# EAGLE board DeMux2 (EAGLE 6.6.0), part 1 of 2
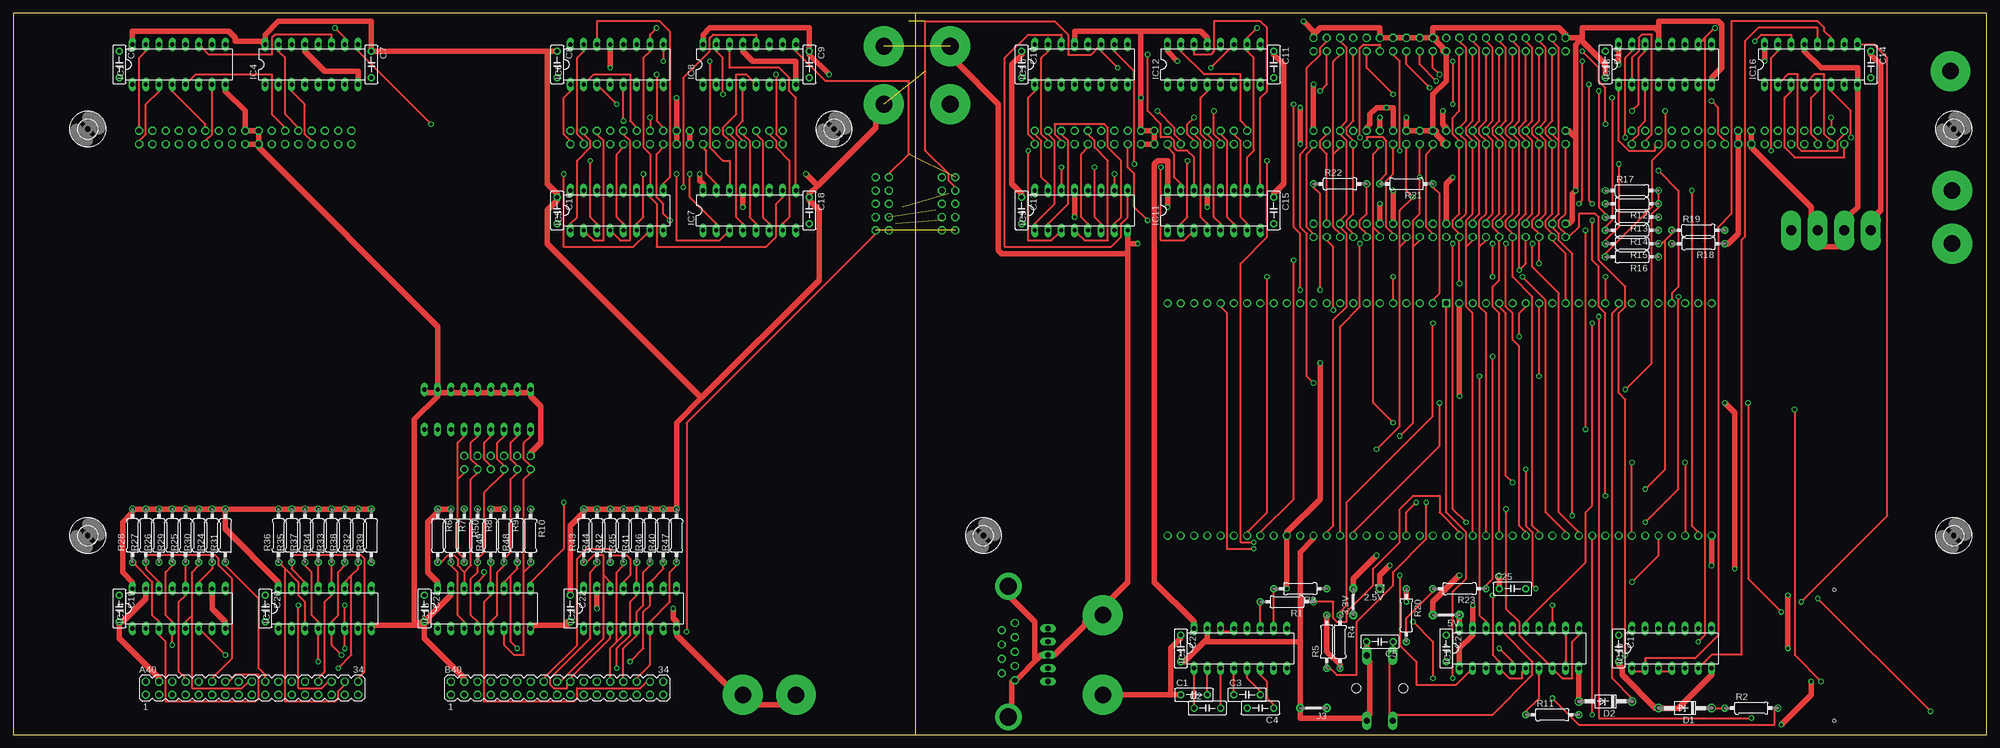
[diagram p3: board, top side]
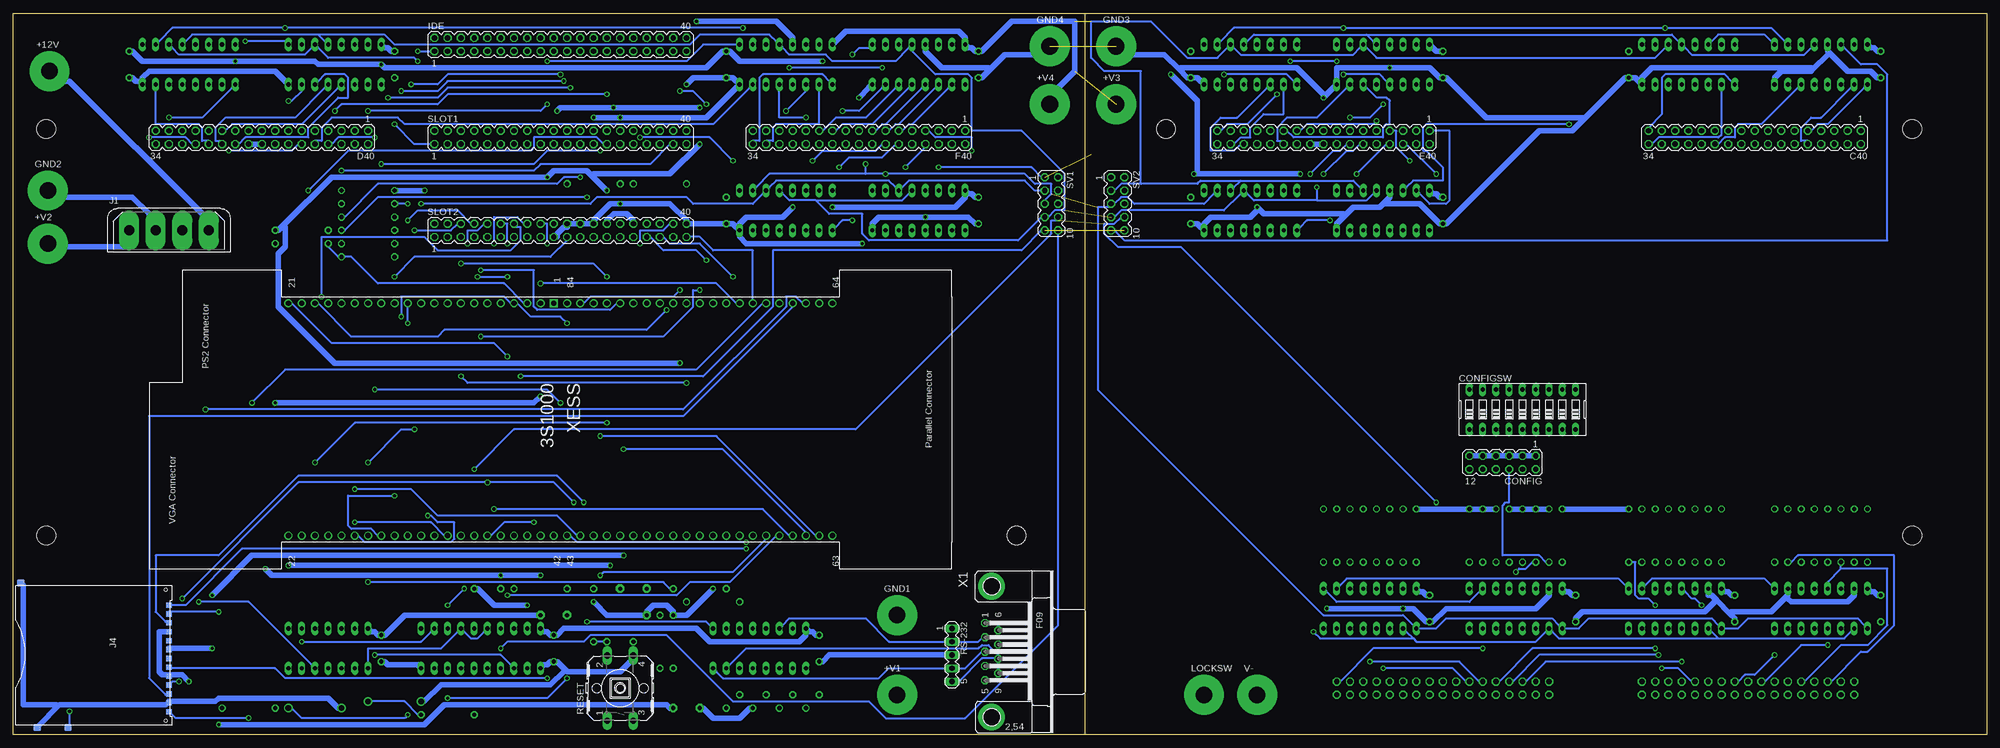
[diagram p4: board, bottom side, seen from below]

Size 377.82 x 138.11 mm. Coordinates in mm from the lower left corner, seen from the top.
Outline: 377.82,138.11 377.82,0 174.62,0 172.72,0
Outline: 377.82,138.11 173.04,138.11
Outline: 173.04,138.11 172.72,138.11
Outline: 172.72,138.11 0,138.11 0,0 172.72,0
Outline: 377.82,138.11 173.04,138.11
Outline: 172.72,138.11 172.72,0
Copper layers (1*16): Top 0.035mm / dielectric 1.5mm / Bottom 0.035mm
Design rules "15mils": minimum track width 15mil, minimum drill 24mil, track to track 15mil, track to pad 10mil, pad to pad 10mil, via to via 10mil, smd to smd 10mil, copper to edge 25mil, drill to drill 10mil, minimum pad ring 10mil, minimum via ring 8mil, stop-mask expansion 0mil, vias tented up to drill 0mil, thermal gap 10mil
Net classes: 1 supply: width 1.016 mm

## Footprints (pad centres in the part's own frame; a part is rotated, then mirrored left to right if it is on the bottom)
1,6/0,8 = drill 0.813 pad 1.6 octagon: 1 0,0
05 = drill 0.813 pad 1.6 octagon: 1 -2.54,0; 2 2.54,0
SPADELUG = drill 3.175 pad 7.62: 1 0,0
MA17-2 = drill 1.016 octagon: 1 -20.32,-1.27; 2 -20.32,1.27; 3 -17.78,-1.27; 4 -17.78,1.27; 5 -15.24,-1.27; 6 -15.24,1.27; 7 -12.7,-1.27; 8 -12.7,1.27; 9 -10.16,-1.27; 10 -10.16,1.27; 11 -7.62,-1.27; 12 -7.62,1.27; 13 -5.08,-1.27; 14 -5.08,1.27; 15 -2.54,-1.27; 16 -2.54,1.27; 17 0,-1.27; 18 0,1.27; 19 2.54,-1.27; 20 2.54,1.27; 21 5.08,-1.27; 22 5.08,1.27; 23 7.62,-1.27; 24 7.62,1.27; 25 10.16,-1.27; 26 10.16,1.27; 27 12.7,-1.27; 28 12.7,1.27; 29 15.24,-1.27; 30 15.24,1.27; 31 17.78,-1.27; 32 17.78,1.27; 33 20.32,-1.27; 34 20.32,1.27
C050-025X075 = drill 0.813 octagon: 1 -2.54,0; 2 2.54,0
MA06-2 = drill 1.016 octagon: 1 -6.35,-1.27; 2 -6.35,1.27; 3 -3.81,-1.27; 4 -3.81,1.27; 5 -1.27,-1.27; 6 -1.27,1.27; 7 1.27,-1.27; 8 1.27,1.27; 9 3.81,-1.27; 10 3.81,1.27; 11 6.35,-1.27; 12 6.35,1.27
EDG-09 = drill 0.813 long: 1 -10.16,-3.81; 2 -7.62,-3.81; 3 -5.08,-3.81; 4 -2.54,-3.81; 5 0,-3.81; 6 2.54,-3.81; 7 5.08,-3.81; 8 7.62,-3.81; 9 10.16,-3.81; 10 10.16,3.81; 11 7.62,3.81; 12 5.08,3.81; 13 2.54,3.81; 14 0,3.81; 15 -2.54,3.81; 16 -5.08,3.81; 17 -7.62,3.81; 18 -10.16,3.81
DO41Z10 = drill 1.118: A 5.08,0; C -5.08,0
DIL16 = drill 0.813 long: 1 -8.89,-3.81; 2 -6.35,-3.81; 3 -3.81,-3.81; 4 -1.27,-3.81; 5 1.27,-3.81; 6 3.81,-3.81; 7 6.35,-3.81; 8 8.89,-3.81; 9 8.89,3.81; 10 6.35,3.81; 11 3.81,3.81; 12 1.27,3.81; 13 -1.27,3.81; 14 -3.81,3.81; 15 -6.35,3.81; 16 -8.89,3.81
DIL20 = drill 0.813 long: 1 -11.43,-3.81; 2 -8.89,-3.81; 3 -6.35,-3.81; 4 -3.81,-3.81; 5 -1.27,-3.81; 6 1.27,-3.81; 7 3.81,-3.81; 8 6.35,-3.81; 9 8.89,-3.81; 10 11.43,-3.81; 11 11.43,3.81; 12 8.89,3.81; 13 6.35,3.81; 14 3.81,3.81; 15 1.27,3.81; 16 -1.27,3.81; 17 -3.81,3.81; 18 -6.35,3.81; 19 -8.89,3.81; 20 -11.43,3.81
DIL14 = drill 0.813 long: 1 -7.62,-3.81; 2 -5.08,-3.81; 3 -2.54,-3.81; 4 0,-3.81; 5 2.54,-3.81; 6 5.08,-3.81; 7 7.62,-3.81; 8 7.62,3.81; 9 5.08,3.81; 10 2.54,3.81; 11 0,3.81; 12 -2.54,3.81; 13 -5.08,3.81; 14 -7.62,3.81
MA20-2 = drill 1.016 octagon: 1 -24.13,-1.27; 2 -24.13,1.27; 3 -21.59,-1.27; 4 -21.59,1.27; 5 -19.05,-1.27; 6 -19.05,1.27; 7 -16.51,-1.27; 8 -16.51,1.27; 9 -13.97,-1.27; 10 -13.97,1.27; 11 -11.43,-1.27; 12 -11.43,1.27; 13 -8.89,-1.27; 14 -8.89,1.27; 15 -6.35,-1.27; 16 -6.35,1.27; 17 -3.81,-1.27; 18 -3.81,1.27; 19 -1.27,-1.27; 20 -1.27,1.27; 21 1.27,-1.27; 22 1.27,1.27; 23 3.81,-1.27; 24 3.81,1.27; 25 6.35,-1.27; 26 6.35,1.27; 27 8.89,-1.27; 28 8.89,1.27; 29 11.43,-1.27; 30 11.43,1.27; 31 13.97,-1.27; 32 13.97,1.27; 33 16.51,-1.27; 34 16.51,1.27; 35 19.05,-1.27; 36 19.05,1.27; 37 21.59,-1.27; 38 21.59,1.27; 39 24.13,-1.27; 40 24.13,1.27
FLOPPY-4 = drill 1.93 pad 3.81 long: 1 7.62,0; 2 2.54,0; 3 -2.54,0; 4 -7.62,0
SCDA5A = smd 1 x 1.3: 1 -7.525,-0.65; 2 -5.825,-0.65; 3 -4.125,-0.65; 3A -2.425,-0.65; 4 -0.725,-0.65; 4A 0.975,-0.65; 5 2.675,-0.65; 6 4.375,-0.65; 7 6.075,-0.65; 8 7.775,-0.65; 9 -9.225,-0.65; 10 11.175,-0.65; 11 9.475,-0.65 | smd 1.4 x 1.4: 12 14.2,-19.955; 13 14.2,-25.875; 14 -13.475,-28.975 | hole 0.61: 12.875,-1.235; -12.125,-1.235
0207/10 = drill 0.813 octagon: 1 -5.08,0; 2 5.08,0
B3F-40XX = drill 1.194 long: 1 -6.248,2.489; 2 6.248,2.489; 3 -6.248,-2.489; 4 6.248,-2.489 | hole 1.803: 0,-4.496; 0,4.496
MA05-1 = drill 1.016 long: 1 -5.08,0; 2 -2.54,0; 3 0,0; 4 2.54,0; 5 5.08,0
MA05-2 = drill 1.016 octagon: 1 -5.08,-1.27; 2 -5.08,1.27; 3 -2.54,-1.27; 4 -2.54,1.27; 5 0,-1.27; 6 0,1.27; 7 2.54,-1.27; 8 2.54,1.27; 9 5.08,-1.27; 10 5.08,1.27
3,6 = hole 3.6: 0,0
F09HP = drill 1.016 octagon: 1 -5.486,-1.27; 2 -2.743,-1.27; 3 0,-1.27; 4 2.743,-1.27; 5 5.486,-1.27; 6 -4.115,1.27; 7 -1.372,1.27; 8 1.372,1.27; 9 4.115,1.27 | drill 3.302 pad 5.08: G1 -12.522,0; G2 12.522,0
3S1000 = drill 1.016 square: 1 0,0 | drill 1.016: 2 0,-2.54; 3 0,-5.08; 4 0,-7.62; 5 0,-10.16; 6 0,-12.7; 7 0,-15.24; 8 0,-17.78; 9 0,-20.32; 10 0,-22.86; 11 0,-25.4; 12 0,-27.94; 13 0,-30.48; 14 0,-33.02; 15 0,-35.56; 16 0,-38.1; 17 0,-40.64; 18 0,-43.18; 19 0,-45.72; 20 0,-48.26; 21 0,-50.8; 22 44.45,-50.8; 23 44.45,-48.26; 24 44.45,-45.72; 25 44.45,-43.18; 26 44.45,-40.64; 27 44.45,-38.1; 28 44.45,-35.56; 29 44.45,-33.02; 30 44.45,-30.48; 31 44.45,-27.94; 32 44.45,-25.4; 33 44.45,-22.86; 34 44.45,-20.32; 35 44.45,-17.78; 36 44.45,-15.24; 37 44.45,-12.7; 38 44.45,-10.16; 39 44.45,-7.62; 40 44.45,-5.08; 41 44.45,-2.54; 42 44.45,0; 43 44.45,2.54; 44 44.45,5.08; 45 44.45,7.62; 46 44.45,10.16; 47 44.45,12.7; 48 44.45,15.24; 49 44.45,17.78; 50 44.45,20.32; 51 44.45,22.86; 52 44.45,25.4; 53 44.45,27.94; 54 44.45,30.48; 55 44.45,33.02; 56 44.45,35.56; 57 44.45,38.1; 58 44.45,40.64; 59 44.45,43.18; 60 44.45,45.72; 61 44.45,48.26; 62 44.45,50.8; 63 44.45,53.34; 64 0,53.34; 65 0,50.8; 66 0,48.26; 67 0,45.72; 68 0,43.18; 69 0,40.64; 70 0,38.1; 71 0,35.56; 72 0,33.02; 73 0,30.48; 74 0,27.94; 75 0,25.4; 76 0,22.86; 77 0,20.32; 78 0,17.78; 79 0,15.24; 80 0,12.7; 81 0,10.16; 82 0,7.62; 83 0,5.08; 84 0,2.54

## Placement (x,y rotation side)
2.5V  [1,6/0,8]  261.62,27.94 180 top
3.3V  J5MM  [05]  256.54,25.4 90 top
5V  J5MM  [05]  274.32,22.86 180 top
+12V  LUG  [SPADELUG]  370.84,127 0 bottom
+V1  LUG  [SPADELUG]  208.6,7.62 0 bottom
+V2  LUG  [SPADELUG]  371.16,93.98 0 bottom
+V3  LUG  [SPADELUG]  166.69,120.65 0 bottom
+V4  LUG  [SPADELUG]  179.39,120.65 0 bottom
A40  [MA17-2]  45.72,8.89 0 top
B40  [MA17-2]  104.14,8.89 0 top
C1  0.1uf  [C050-025X075]  226.06,7.62 0 top
C2  0.1uf  [C050-025X075]  228.6,5.08 0 top
C3  0.1uf  [C050-025X075]  236.22,7.62 0 top
C4  0.1uf  [C050-025X075]  238.76,5.08 180 top
C5  0.1uf  [C050-025X075]  261.62,17.78 180 top
C6  0.1uf  [C050-025X075]  20.32,128.27 270 top
C7  0.1uf  [C050-025X075]  68.58,128.27 270 top
C8  0.1uf  [C050-025X075]  104.14,128.27 270 top
C9  0.1uf  [C050-025X075]  152.4,128.27 270 top
C10  0.1uf  [C050-025X075]  193.04,128.27 270 top
C11  0.1uf  [C050-025X075]  241.3,128.27 270 top
C12  0.1uf  [C050-025X075]  304.8,128.27 270 top
C13  0.1uf  [C050-025X075]  193.04,100.33 270 top
C14  0.1uf  [C050-025X075]  355.6,128.27 270 top
C15  0.1uf  [C050-025X075]  241.3,100.33 270 top
C16  0.1uf  [C050-025X075]  104.14,100.33 270 top
C17  0.1uf  [C050-025X075]  307.34,16.51 270 top
C18  0.1uf  [C050-025X075]  152.4,100.33 270 top
C19  0.1uf  [C050-025X075]  20.32,24.13 270 top
C20  0.1uf  [C050-025X075]  48.26,24.13 270 top
C21  0.1uf  [C050-025X075]  78.74,24.13 270 top
C22  0.1uf  [C050-025X075]  106.68,24.13 270 top
C23  0.1uf  [C050-025X075]  223.52,16.51 270 top
C24  0.1uf  [C050-025X075]  274.32,16.51 270 top
C25  0.1uf  [C050-025X075]  287.02,27.94 0 top
C40  [MA17-2]  44.45,114.3 180 bottom
CONFIG  [MA06-2]  92.71,52.07 180 bottom
CONFIGSW  [EDG-09]  88.9,62.23 0 bottom
D1  1N4728  [DO41Z10]  320.04,5.08 180 top
D2  1N4728  [DO41Z10]  304.8,6.35 180 top
D40  [MA17-2]  330.2,114.3 180 bottom
E40  [MA17-2]  127,114.3 180 bottom
F40  [MA17-2]  215.9,114.3 180 bottom
GND1  LUG  [SPADELUG]  208.6,22.86 0 bottom
GND2  LUG  [SPADELUG]  371.16,104.14 0 bottom
GND3  LUG  [SPADELUG]  166.69,131.76 0 bottom
GND4  LUG  [SPADELUG]  179.39,131.76 0 bottom
IC1  74HC595N  [DIL16]  31.75,128.27 0 top
IC2  74HC165N  [DIL16]  118.11,24.13 0 top
IC3  MAX232A  [DIL16]  234.95,16.51 0 top
IC4  74HC595N  [DIL16]  57.15,128.27 0 top
IC5  74HC595N  [DIL16]  115.57,100.33 0 top
IC6  74HC595N  [DIL16]  115.57,128.27 0 top
IC7  74HC595N  [DIL16]  140.97,100.33 0 top
IC8  74HC595N  [DIL16]  140.97,128.27 0 top
IC9  74HC595N  [DIL16]  204.47,100.33 0 top
IC10  74HC595N  [DIL16]  204.47,128.27 0 top
IC11  74HC595N  [DIL16]  229.87,100.33 0 top
IC12  74HC595N  [DIL16]  229.87,128.27 0 top
IC13  74HC595N  [DIL16]  316.23,128.27 0 top
IC14  74HC165N  [DIL16]  31.75,24.13 0 top
IC15  74HC165N  [DIL16]  59.69,24.13 0 top
IC16  74HC595N  [DIL16]  344.17,128.27 0 top
IC17  74LS244N  [DIL20]  288.29,16.51 0 top
IC18  74HC165N  [DIL16]  90.17,24.13 0 top
IC19  74ALS00N  [DIL14]  317.5,16.51 0 top
IDE  [MA20-2]  273.05,132.08 0 bottom
J1  [FLOPPY-4]  347.98,96.52 0 bottom
J3  J5MM  [05]  248.92,5.08 180 top
J4  SDCARD  [SCDA5A]  347.35,15.56 270 bottom
LOCKSW  LUG  [SPADELUG]  149.86,7.62 0 bottom
R1  330  [0207/10]  243.84,25.4 180 top
R2  330  [0207/10]  332.74,5.08 0 top
R3  330  [0207/10]  246.38,27.94 180 top
R4  330  [0207/10]  254,17.78 270 top
R5  330  [0207/10]  251.46,17.78 90 top
R6  3K  [0207/10]  81.28,38.1 270 top
R7  3K  [0207/10]  83.82,38.1 270 top
R8  3K  [0207/10]  88.9,38.1 270 top
R9  3K  [0207/10]  93.98,38.1 270 top
R10  3K  [0207/10]  99.06,38.1 270 top
R11  330  [0207/10]  294.64,3.81 0 top
R12  330  [0207/10]  309.88,101.6 180 top
R13  47  [0207/10]  309.88,99.06 180 top
R14  47  [0207/10]  309.88,96.52 180 top
R15  330  [0207/10]  309.88,93.98 180 top
R16  330  [0207/10]  309.88,91.44 180 top
R17  10K  [0207/10]  309.88,104.14 0 top
R18  10K  [0207/10]  322.58,93.98 180 top
R19  10K  [0207/10]  322.58,96.52 0 top
R20  4.7K  [0207/10]  266.7,22.86 270 top
R21  330  [0207/10]  266.7,105.41 180 top
R22  330  [0207/10]  254,105.41 0 top
R23  330  [0207/10]  276.86,27.94 180 top
R24  3K  [0207/10]  38.1,38.1 90 top
R25  3K  [0207/10]  33.02,38.1 90 top
R26  3K  [0207/10]  27.94,38.1 90 top
R27  3K  [0207/10]  25.4,38.1 90 top
R28  3K  [0207/10]  22.86,38.1 90 top
R29  3K  [0207/10]  30.48,38.1 90 top
R30  3K  [0207/10]  35.56,38.1 90 top
R31  3K  [0207/10]  40.64,38.1 90 top
R32  3K  [0207/10]  66.04,38.1 90 top
R33  3K  [0207/10]  60.96,38.1 90 top
R34  3K  [0207/10]  58.42,38.1 90 top
R35  3K  [0207/10]  53.34,38.1 90 top
R36  3K  [0207/10]  50.8,38.1 90 top
R37  3K  [0207/10]  55.88,38.1 90 top
R38  3K  [0207/10]  63.5,38.1 90 top
R39  3K  [0207/10]  68.58,38.1 90 top
R40  3K  [0207/10]  124.46,38.1 90 top
R41  3K  [0207/10]  119.38,38.1 90 top
R42  3K  [0207/10]  114.3,38.1 90 top
R43  3K  [0207/10]  109.22,38.1 90 top
R44  3K  [0207/10]  111.76,38.1 90 top
R45  3K  [0207/10]  116.84,38.1 90 top
R46  3K  [0207/10]  121.92,38.1 90 top
R47  3K  [0207/10]  127,38.1 90 top
R48  3K  [0207/10]  96.52,38.1 90 top
R49  3K  [0207/10]  91.44,38.1 90 top
R50  3K  [0207/10]  86.36,38.1 270 top
RESET  [B3F-40XX]  261.62,8.89 90 bottom
RS-232  [MA05-1]  198.12,15.24 270 bottom
SLOT1  [MA20-2]  273.05,114.3 0 bottom
SLOT2  [MA20-2]  273.05,96.52 0 bottom
SV1  [MA05-2]  179.07,101.6 270 bottom
SV2  [MA05-2]  166.37,101.6 270 bottom
U$5  [3,6]  371.48,115.89 0 top
U$6  [3,6]  371.48,38.1 0 top
U$7  [3,6]  185.74,38.1 0 top
U$8  [3,6]  14.29,38.1 0 top
U$9  [3,6]  14.29,115.89 0 top
U$11  [3,6]  157.16,115.89 0 top
V-  LUG  [SPADELUG]  139.7,7.62 0 bottom
X1  [F09HP]  190.5,15.88 270 bottom
XESS  3S1000  [3S1000]  274.32,82.55 270 bottom

## Tracks (layer width: path | path; a pad name or v marks a point on that pad's centre or on a via)
3S-LSCK  (via drill 0.61)
  Top 0.381: IC17.6 288.93,12.06 288.93,10.79 286.38,10.79 285.12,12.06 IC17.4 284.48,13.97 283.21,15.24 v283.21,26.67
  Bottom 0.381: v283.21,26.67 250.82,26.67 248.28,29.21 240.66,29.21 231.78,38.1 XESS.59
3S-LSER  (via drill 0.61)
  Top 0.381: v265.43,30.48 265.43,17.14 268.61,13.97 268.61,9.53 276.23,9.53 278.76,12.06 IC17.2
  Bottom 0.381: v265.43,30.48 264.8,31.11 240.03,31.11 233.68,37.47 XESS.58
3S-SCLK  (via drill 0.61)
  Top 0.381: v302.26,78.74 302.26,43.81 300.99,42.55 300.99,33.02 289.56,21.59 IC17.15
  Bottom 0.381: v302.26,78.74 302.26,81.92 XESS.12
3S-SSER
  Top 0.381: XESS.14 307.34,81.92 306.07,80.64 306.07,10.79 309.88,6.99 D2.C
  Bottom 0.381: R11.2 300.36,3.81 302.89,6.35 309.25,6.35 D2.C
!3S-SCL  (via drill 0.61)
  Top 0.381: IC17.11 299.72,19.05 298.45,17.78 298.45,10.79 296.55,10.79 295.27,12.06 IC17.8 294,13.34 288.29,19.05 288.29,21.59 285.75,24.13 v285.75,43.18
  Bottom 0.381: v285.75,43.18 234.31,43.18 229.24,38.1 XESS.60
!SCL  (via drill 0.61)  (1 unrouted)
  Top 0.381: v210.82,107.31 210.82,105.41 IC9.10 | v214.63,109.22 214.63,127 210.82,130.81 IC10.10 | IC11.10 236.22,105.41 236.22,110.49 237.49,111.76 237.49,129.54 236.22,130.81 IC12.10 236.22,133.35 v238.12,135.25 | IC17.9 297.18,13.97 297.18,19.05 IC17.12 | v325.75,135.25 323.85,133.35 | 323.85,133.35 323.21,132.72 IC13.10 | v322.58,17.78 323.85,19.05 323.85,133.35 | v61.59,135.25 63.5,133.35 IC4.10 | v123.19,135.25 121.92,133.99 121.92,133.35 IC6.10 121.92,130.81 120.65,129.54 120.65,112.39 121.92,111.12 121.92,105.41 IC5.10 121.92,102.87 123.19,101.6 123.19,93.34 144.15,93.34 146.05,95.25 146.05,101.6 147.32,102.87 IC7.10
  Bottom 0.381: 214.63,107.31 233.04,107.31 235.59,104.78 IC11.10 | 214.63,107.31 v210.82,107.31 184.15,107.31 182.25,105.41 179.07,105.41 179.07,103.5 180.34,102.23 SV1.5 | 214.63,107.31 v214.63,109.22 | IC16.10 349.88,132.72 347.35,135.25 v325.75,135.25 v238.12,135.25 | v322.58,17.78 299.72,17.78 297.81,19.68 IC17.12 | IC14.1 23.5,20.95 24.77,22.23 45.72,22.23 47.62,20.32 50.16,20.32 IC15.1 51.44,20.95 52.7,22.23 76.2,22.23 78.11,20.32 80.64,20.32 IC18.1 81.92,20.95 83.19,22.23 103.5,22.23 105.41,20.32 108.58,20.32 IC2.1 109.86,20.95 111.76,22.86 127,22.86 170.18,66.04 170.18,100.97 167.64,100.97 SV2.5 167,101.6 165.74,102.87 164.47,102.87 163.19,101.6 149.86,101.6 147.96,103.5 IC7.10 | IC1.10 38.73,132.72 41.27,135.25 v61.59,135.25 v123.19,135.25 144.15,135.25 146.69,132.72 IC8.10
+2V5  (via drill 0.61)
  Top 1.016: v325.12,32.38 325.12,37.47 XESS.22 | v263.52,32.38 261.62,30.48 261.62,28.57 2.5V.1
  Bottom 1.016: v263.52,32.38 v325.12,32.38
+3V3  (via drill 0.61)
  Top 1.016: R4.2 254,13.34 251.46,15.88 251.46,22.23 R5.2 | v266.7,25.4 266.7,27.3 R20.1 | v243.84,27.94 243.84,37.47 XESS.54 243.84,38.73 250.19,45.09 v250.19,71.12 | SLOT1.32 259.08,116.2 259.71,116.84 259.71,118.75 260.99,120.02 v262.89,120.02 264.16,120.02 264.16,116.2 SLOT1.28 | v273.69,119.38 273.69,116.84 274.32,116.2 SLOT1.20 | v275.59,106.68 274.32,105.41 274.32,98.42 SLOT2.20 | v264.16,104.14 264.16,98.42 SLOT2.28 | v246.38,113.03 v246.38,120.02
  Bottom 1.016: v266.7,25.4 264.16,22.86 257.18,22.86 3.3V.1 256.54,23.5 255.27,24.77 252.73,24.77 251.46,23.5 R5.2 250.82,22.86 248.92,22.86 v243.84,27.94 | v273.69,119.38 273.05,120.02 v262.89,120.02 v246.38,120.02 | SLOT2.32 259.08,98.42 260.35,99.69 262.89,99.69 264.16,98.42 SLOT2.28 | 326.07,97.47 316.87,106.68 v275.59,106.68 274.32,107.95 267.97,107.95 267.02,107 | 326.07,97.47 327.02,96.52 R19.2 | 267.02,107 v264.16,104.14 | v246.38,113.03 252.09,107.31 266.7,107.31 267.02,107 | v250.19,71.12 316.23,71.12 327.02,81.92 327.02,92.08 325.75,93.34 325.75,97.16 326.07,97.47
+5V  (via drill 0.61)
  Top 1.016: v284.48,30.48 284.48,28.57 C25.1 | v276.86,30.48 271.78,25.4 271.78,23.5 5V.2 | v276.86,64.77 276.86,81.92 XESS.2 | v327.66,63.5 329.56,61.59 v329.56,31.75
  Bottom 1.016: v276.86,30.48 v284.48,30.48 328.3,30.48 v329.56,31.75 | v276.86,64.77 278.13,63.5 v327.66,63.5
+12V
  Bottom 1.016: J1.1 341.63,99.69 367.03,125.09 367.67,125.09 +12V.1
AC0  (via drill 0.61)
  Top 0.381: v110.49,109.86 110.49,99.06 111.76,97.79 IC5.3
  Bottom 0.381: v110.49,109.86 113.03,112.39 113.03,115.57 113.67,115.57 E40.7
AC1
  Top 0.381: IC6.15 109.22,130.81 107.95,129.54 107.95,114.94 109.22,113.67 E40.4
AC2  (via drill 0.61)
  Top 0.381: v116.84,117.47 116.84,123.19 IC6.5
  Bottom 0.381: v116.84,117.47 117.47,116.84 130.18,116.84 131.44,115.57 E40.21
AC3  (via drill 0.61)
  Top 0.381: v129.54,107.31 129.54,102.87 134.62,97.79 IC7.2
  Bottom 0.381: v129.54,107.31 125.09,111.76 123.83,111.76 122.56,113.03 E40.14
AC4
  Top 0.381: IC7.7 147.32,97.79 148.59,99.06 148.59,109.86 146.05,112.39 146.05,113.67 144.78,114.94 E40.31
AC5
  Top 0.381: IC8.4 139.7,123.19 139.7,117.47 138.43,116.2 138.43,114.94 139.7,113.67 E40.28
AC6  (via drill 0.61)
  Top 0.381: v194.31,111.76 194.31,94.61 198.75,94.61 200.03,95.89 IC9.3
  Bottom 0.381: v194.31,111.76 194.31,114.3 201.29,114.3 202.56,115.57 F40.7
AC7
  Top 0.381: IC10.15 198.12,130.81 196.85,129.54 196.85,114.94 198.12,113.67 F40.4
AC8
  Bottom 0.381: IC10.5 206.38,123.83 213.36,116.84 219.07,116.84 220.34,115.57 F40.21
AC9  (via drill 0.61)
  Top 0.381: v224.79,109.86 224.79,99.06 223.52,97.79 IC11.2
  Bottom 0.381: v224.79,109.86 222.88,111.76 212.72,111.76 211.46,113.03 F40.14
AC10
  Top 0.381: IC11.7 236.22,97.79 234.95,99.06 234.95,113.67 233.68,114.94 F40.31
AC11
  Top 0.381: IC12.4 228.6,123.19 227.33,121.92 227.33,114.94 228.6,113.67 F40.28
AND
  Top 0.381: IC13.3 312.42,123.19 312.42,117.47 311.15,116.2 311.15,114.94 309.88,113.67 D40.2
BREAK
  Bottom 0.381: IC13.6 319.4,125.09 318.13,126.36 314.32,126.36 313.69,125.73 313.69,121.92 315.6,121.92 321.31,116.2 321.31,114.3 333.38,114.3 334.64,113.03 D40.22
CA
  Top 0.381: IC16.4 343.54,125.09 344.81,126.36 346.71,126.36 346.71,114.94 347.98,113.67 D40.32
CF1  (via drill 0.61)
  Top 0.381: 85.09,48.9 85.09,34.92 86.36,33.66 R50.2 | 85.09,48.9 86.36,50.16 CONFIG.2 | 85.09,48.9 85.09,55.88 86.36,57.15 CONFIGSW.6 | v90.17,31.11 90.17,30.48 88.9,29.21 IC18.13
  Bottom 0.381: v90.17,31.11 89.53,31.75 88.27,31.75 87,33.02 R50.2
CF2
  Top 0.381: CONFIGSW.5 88.9,57.15 87.63,55.88 87.63,52.7 88.9,51.44 CONFIG.4 88.9,50.16 87.63,48.9 87.63,32.38 86.36,31.11 | 86.36,31.11 85.09,32.38 85.09,33.66 84.45,34.29 83.19,34.29 81.92,33.02 R6.2 | 86.36,31.11 86.36,29.21 IC18.14
CF3
  Top 0.381: CONFIGSW.4 91.44,57.15 90.17,55.88 90.17,52.7 91.44,51.44 CONFIG.6 | IC18.3 86.36,21.59 85.09,22.86 85.09,31.11 83.82,32.38 R7.2
  Bottom 0.381: CONFIG.6 91.44,50.16 91.44,44.45 92.08,44.45 92.71,43.81 92.71,34.29 85.72,34.29 84.45,33.02 R7.2
CF4
  Top 0.381: CONFIGSW.3 93.98,57.15 92.71,55.88 92.71,52.7 93.98,51.44 CONFIG.8 93.98,50.16 90.17,46.35 90.17,34.92 88.9,33.66 R8.2 88.9,32.38 88.9,31.11 87.63,29.84 87.63,22.86 88.9,21.59 IC18.4
CF5
  Top 0.381: CONFIGSW.2 96.52,57.15 95.25,55.88 95.25,52.7 96.52,51.44 CONFIG.10 96.52,50.16 95.25,48.9 95.25,34.92 93.98,33.66 R9.2 93.98,32.38 92.71,31.11 92.71,22.86 91.44,21.59 IC18.5
CF6
  Top 0.381: CONFIGSW.1 99.06,57.15 97.79,55.88 97.79,52.7 99.06,51.44 CONFIG.12 99.06,50.16 97.79,48.9 97.79,31.11 | 97.79,31.11 97.79,15.24 95.89,15.24 93.98,17.14 93.98,19.05 IC18.6 | 97.79,31.11 99.06,32.38 R10.2
CLK  (via drill 0.61)
  Top 0.381: SLOT2.21 271.78,95.89 270.51,97.16 270.51,111.12 271.78,112.39 SLOT1.21 | v304.8,87.63 304.8,83.19 XESS.13
  Bottom 0.381: v304.8,87.63 300.99,91.44 274.95,91.44 271.78,94.61 SLOT2.21
CONT
  Top 0.381: B40.28 116.84,10.79 116.84,16.51 119.38,19.05 IC2.5 119.38,21.59 119.38,23.5 120.65,24.77 120.65,31.11 121.92,32.38 R46.1
DCA  (via drill 0.61)
  Top 0.381: v308.61,114.3 308.61,129.54 309.88,130.81 IC13.15
  Bottom 0.381: v308.61,114.3 315.6,114.3 316.87,113.03 D40.8
DEFER
  Bottom 0.381: IC16.7 350.52,123.19 350.52,116.84 342.26,116.84 341.63,116.2 341.63,113.67 340.36,113.67 D40.26
DEP
  Top 0.381: IC2.3 114.3,19.05 114.3,18.41 106.68,10.79 B40.20 106.05,10.16 106.05,8.89 103.5,8.89 102.87,9.53 102.87,10.79 110.49,18.41 110.49,31.11 111.76,32.38 R44.1
DF0
  Top 0.381: IC1.15 25.4,130.81 24.13,129.54 24.13,116.2 C40.1
DF1
  Bottom 0.381: IC1.2 26.04,123.83 31.75,118.11 33.66,118.11 35.56,116.2 35.56,113.67 34.29,113.67 C40.10
DF2
  Top 0.381: IC1.4 30.48,123.19 36.83,116.84 36.83,116.2 C40.11
EXAM
  Top 0.381: 115.57,17.78 114.3,16.51 114.3,10.79 B40.26 | 115.57,17.78 116.84,19.05 IC2.4 | 115.57,17.78 115.57,31.11 116.84,32.38 R45.1
EXECUTE  (via drill 0.61)
  Top 0.381: v351.79,114.3 351.79,119.38 347.98,123.19 IC16.6
  Bottom 0.381: v351.79,114.3 344.81,114.3 343.54,113.03 D40.28
FETCH
  Bottom 0.381: IC13.5 318.13,123.83 323.85,118.11 337.19,118.11 339.09,116.2 339.09,113.67 337.82,113.67 D40.24
GND  (via drill 0.61)  (1 unrouted)
  Top 1.016: IC16.13 342.9,130.81 346.07,127.64 353.06,127.64 353.06,125.73 IC16.8 353.06,123.19 353.06,100.97 351.79,99.69 J1.3 349.25,93.34 346.71,93.34 J1.2 344.17,99.69 344.17,100.97 332.74,112.39 D40.20 332.74,113.67 332.74,114.94 D40.19 | R18.1 328.3,93.98 330.2,95.89 330.2,112.39 D40.18 330.2,113.67 330.2,114.94 D40.17 | F40.18 216.53,113.03 217.81,113.03 F40.20 218.44,113.67 218.44,114.94 F40.19 217.81,115.57 216.53,115.57 F40.17 215.9,116.2 v215.9,121.92 215.9,134.62 | 215.9,134.62 227.33,134.62 228.6,133.35 IC12.13 | 215.9,134.62 203.2,134.62 203.2,133.35 IC10.13 | 300.04,133.03 299.72,133.35 297.81,133.35 IDE.2 297.18,133.99 295.91,135.25 271.78,135.25 271.78,133.99 IDE.22 | 300.04,133.03 304.8,128.27 304.8,126.36 C12.2 | 314.64,134.94 314.32,135.25 300.36,135.25 300.36,133.35 300.04,133.03 | 314.64,134.94 314.96,134.62 314.96,133.35 IC13.13 | SLOT2.2 297.81,97.79 298.45,98.42 298.45,103.5 v299.08,104.14 299.08,114.3 298.77,114.62 | 298.77,114.62 297.81,115.57 SLOT1.2 | 300.04,133.03 299.72,132.72 299.08,132.08 299.08,114.94 298.77,114.62 | v248.92,124.46 248.92,116.2 SLOT1.40 | v261.62,118.11 261.62,116.2 SLOT1.30 | SLOT1.22 271.14,115.57 269.88,115.57 SLOT1.24 268.61,115.57 267.33,115.57 SLOT1.26 266.7,116.2 v266.7,118.11 | SLOT1.19 273.69,113.03 273.69,113.67 272.42,114.94 272.42,115.57 SLOT1.22 | 249.24,134.3 250.19,135.25 261.62,135.25 261.62,133.99 IDE.30 262.25,133.35 263.52,133.35 IDE.28 264.8,133.35 266.06,133.35 IDE.26 267.33,133.35 268.61,133.35 IDE.24 269.88,133.35 271.14,133.35 IDE.22 | 249.24,134.3 248.92,133.99 IDE.40
  Top 1.016: IDE.22 272.42,133.35 272.42,132.72 273.69,131.44 273.69,130.81 IDE.19 274.32,130.18 274.32,125.09 271.78,122.56 271.78,116.2 SLOT1.22 | v247.01,136.53 248.92,134.62 249.24,134.3 | IC13.8 325.12,125.73 327.02,127.64 327.02,135.89 326.39,136.53 314.96,136.53 314.96,135.25 314.64,134.94 | IC17.10 299.72,11.43 299.72,6.99 D2.A | IC19.7 325.12,11.43 318.77,5.08 315.6,5.08 D1.A 314.32,5.08 307.98,11.43 307.98,12.7 307.34,13.34 C17.2 | IC17.1 276.86,13.97 276.86,16.51 279.4,19.05 IC17.19 279.4,21.59 v279.4,24.77 | C5.2 259.08,17.14 259.08,16.51 RESET.4 259.71,13.97 259.71,3.81 RESET.3 258.44,3.17 246.38,3.17 246.38,4.45 J3.2 246.38,5.71 246.38,17.78 | 228.28,18.1 228.6,18.41 228.6,19.05 IC3.15 | 228.28,18.1 224.16,13.97 C23.2 | 246.38,17.78 246.38,34.92 248.92,37.47 XESS.52 | 246.38,17.78 228.6,17.78 228.28,18.1 | v261.62,101.6 261.62,98.42 SLOT2.30 | v228.6,100.97 228.6,102.87 IC11.13 | X1.G2 191.13,5.71 191.13,10.16 X1.5 192.41,10.79 195.9,14.29 | 195.9,14.29 196.85,15.24 RS-232.3 199.39,15.24 205.1,20.95 205.1,21.59 GND1.1 210.19,26.04 213.36,29.21 213.36,92.08 | X1.G1 191.13,26.04 195.58,21.59 195.58,14.61 195.9,14.29 | v203.2,99.06 203.2,102.87 IC9.13 | 213.36,92.08 213.36,93.98 | 213.36,93.98 213.36,95.25 IC9.8 | 213.36,93.98 v215.26,93.98 | 213.36,92.08 189.23,92.08 188.59,92.71 188.59,120.65 180.97,128.27 GND4.1 | E40.18 127,113.67 127,114.94 E40.17 127,116.2 v127,121.92 | E40.19 129.54,114.94 129.54,113.67 E40.20 | v114.3,127.64 114.3,130.81 IC6.13 | IC8.13 139.7,130.81 141.6,128.91 149.86,128.91 149.86,125.73 IC8.8 | v139.7,100.97 139.7,102.87 IC7.13
  Top 1.016: IC4.13 55.88,130.81 59.69,127 66.04,127 66.04,125.73 IC4.8 | C40.18 45.09,113.03 46.35,113.03 C40.20 | C40.20 46.99,113.67 46.99,114.94 C40.19 46.35,115.57 45.09,115.57 C40.17 44.45,116.2 44.45,119.38 40.64,123.19 IC1.8 | LOCKSW.1 146.69,5.71 142.88,5.71 V-.1 136.53,9.53 127,19.05 IC2.8 127,21.59 126.36,22.23 v126.36,24.13 | IC14.8 40.64,21.59 38.1,24.13 38.1,26.67 IC14.10 | IC14.15 25.4,26.67 25.4,26.04 20.95,21.59 C19.2 20.32,20.95 20.32,18.41 27.94,10.79 A40.4 | CONFIGSW.11 81.92,65.41 83.19,65.41 CONFIGSW.12 84.45,65.41 85.72,65.41 CONFIGSW.13 87,65.41 88.27,65.41 CONFIGSW.14 89.53,65.41 90.81,65.41 CONFIGSW.15 92.08,65.41 93.34,65.41 CONFIGSW.16 94.61,65.41 95.89,65.41 CONFIGSW.17 97.16,65.41 98.42,65.41 CONFIGSW.18 99.06,64.77 100.97,62.87 100.97,55.88 99.06,53.98 CONFIG.11 | IC18.8 99.69,20.95 106.05,20.95 106.05,21.59 C22.2 | v111.76,24.13 111.76,26.67 IC2.15 | 76.83,20.95 78.11,20.95 78.11,21.59 C21.2 | 76.83,20.95 69.22,20.95 IC15.8 | IC18.15 83.82,26.67 79.38,22.23 79.38,21.59 C21.2 | B40.4 86.36,10.79 78.74,18.41 78.74,20.95 C21.2 | 76.83,20.95 76.83,60.33 81.28,64.77 CONFIGSW.11 | C40.20 46.99,112.39 81.28,78.11 81.28,67.31 CONFIGSW.11 | CONFIGSW.10 79.38,65.41 80.64,65.41 CONFIGSW.11
  Bottom 1.016: IC13.8 325.75,125.09 327.66,127 351.79,127 353.06,125.73 IC16.8 353.69,125.09 354.33,125.09 354.96,125.73 C14.2 | D40.20 332.11,113.03 330.83,113.03 D40.18 | J1.3 351.79,99.69 354.96,102.87 367.67,102.87 GND2.1 | v215.9,121.92 214,123.83 IC10.8 | 190.82,127.32 187.96,130.18 182.88,130.18 GND4.1 | 190.82,127.32 192.41,125.73 C10.2 | IC10.13 203.2,130.81 200.03,127.64 191.13,127.64 190.82,127.32 | v299.08,104.14 304.17,104.14 R17.1 | v248.92,124.46 247.65,125.73 241.94,125.73 C11.2 240.66,125.73 240.03,125.73 239.4,125.09 IC12.8 239.4,123.83 245.11,118.11 v261.62,118.11 v266.7,118.11 | v247.01,136.53 231.78,136.53 228.6,133.35 IC12.13 | 369.25,5.4 372.75,1.91 J4.13 | 369.25,5.4 368.94,5.71 348.62,5.71 J4.11 347.98,6.35 339.09,6.35 338.45,6.99 317.5,6.99 315.6,5.08 D1.A | J4.14 375.92,28.57 375.92,5.71 369.57,5.71 369.25,5.4 | C17.2 306.7,13.97 306.07,13.34 300.36,13.34 IC17.10 | IC17.1 276.23,13.34 275.59,13.34 274.95,13.97 C24.2 273.69,13.97 272.1,12.38 | v279.4,24.77 285.75,24.77 288.93,27.94 C25.2 | C4.2 236.85,5.08 238.76,3.17 243.84,3.17 245.75,5.08 J3.2 | 272.1,12.38 271.78,12.06 261.62,12.06 259.71,13.97 RESET.4 | D2.A 299.08,6.35 295.91,9.53 274.95,9.53 272.42,12.06 272.1,12.38 | SLOT2.19 273.69,95.25 273.69,95.89 272.42,97.16 271.78,97.16 SLOT2.22 271.14,97.79 269.88,97.79 SLOT2.24 268.61,97.79 267.33,97.79 SLOT2.26 266.7,98.42 263.52,101.6 v261.62,101.6 252.09,101.6 248.92,98.42 SLOT2.40 248.28,97.79 241.94,97.79 C15.2 240.66,97.79 240.03,97.79 239.4,97.16 IC11.8 | v228.6,100.97 230.5,99.06 237.49,99.06 238.76,97.79 IC11.8 | IC9.8 213.36,97.79 212.09,99.06 v203.2,99.06 194.94,99.06 193.68,97.79 C13.2
  Bottom 1.016: v215.26,93.98 237.49,93.98 238.76,95.25 IC11.8 | C23.2 222.88,13.97 221.62,15.24 199.39,15.24 RS-232.3 | E40.18 127.64,113.03 128.91,113.03 E40.20 | 126.68,122.24 125.09,123.83 IC6.8 124.46,125.73 124.46,127.64 v114.3,127.64 106.68,127.64 104.78,125.73 C8.2 103.5,125.73 95.89,118.11 77.47,118.11 77.15,117.79 | 126.68,122.24 v127,121.92 | IC8.8 150.5,125.09 151.13,125.73 151.76,125.73 C9.2 153.03,125.73 154.62,127.32 | 154.62,127.32 157.48,130.18 163.19,130.18 GND3.1 | 126.68,122.24 127,122.56 132.08,127.64 154.31,127.64 154.62,127.32 | C18.2 151.76,97.79 151.13,97.79 150.5,97.16 IC7.8 149.86,97.79 148.59,99.06 140.97,99.06 139.7,100.33 139.38,100.65 | 122.87,99.38 121.28,100.97 116.2,100.97 115.25,101.92 | 122.87,99.38 124.46,97.79 IC5.8 | 115.25,101.92 114.3,102.87 IC5.13 | 115.25,101.92 114.94,101.6 108.58,101.6 104.78,97.79 C16.2 103.5,97.79 85.72,115.57 79.38,115.57 77.15,117.79 | 139.38,100.65 138.43,99.69 123.19,99.69 122.87,99.38 | 139.38,100.65 v139.7,100.97 | 30.16,130.49 30.48,130.81 IC1.13 | 30.16,130.49 26.67,127 22.23,127 20.95,125.73 C6.2 | 33.34,127.32 33.66,127 39.37,127 40.64,125.73 IC1.8 | 33.34,127.32 30.48,130.18 30.16,130.49 | 33.34,127.32 33.66,127.64 64.14,127.64 66.04,125.73 IC4.8 66.67,125.09 67.31,125.73 67.94,125.73 C7.2 69.22,125.73 77.15,117.79 | 51.75,25.72 52.7,26.67 53.34,26.67 IC15.15 | 51.75,25.72 49.21,23.18 | 49.21,23.18 48.26,22.23 C20.2 | 38.42,26.35 41.27,23.5 48.9,23.5 49.21,23.18 | 38.42,26.35 38.1,26.67 IC14.10 | 38.42,26.35 38.1,26.04 37.47,25.4 26.67,25.4 25.4,26.67 IC14.15 | CONFIG.1 87,53.34 88.27,53.34 CONFIG.3 89.53,53.34 90.81,53.34 CONFIG.5 92.08,53.34 93.34,53.34 CONFIG.7 94.61,53.34 95.89,53.34 CONFIG.9 97.16,53.34 98.42,53.34 CONFIG.11
  Bottom 1.016: IC18.15 83.82,26.67 86.36,24.13 103.5,24.13 106.05,21.59 C22.2 107.31,21.59 109.86,24.13 v111.76,24.13 v126.36,24.13 | 51.75,25.72 52.07,25.4 53.98,23.5 77.47,23.5 78.74,22.23 C21.2
I2C-SCL  (via drill 0.61)
  Top 0.381: SLOT2.27 264.16,95.89 262.89,97.16 262.89,106.05 264.16,107.31 264.16,112.39 SLOT1.27 | v321.31,104.14 321.31,40.01 322.58,38.73 XESS.23
  Bottom 0.381: v321.31,104.14 313.69,111.76 278.76,111.76 278.13,112.39 278.13,114.3 266.06,114.3 264.8,113.03 SLOT1.27
I2C-SDA  (via drill 0.61)
  Top 0.381: 260.35,97.16 261.62,95.89 SLOT2.29 | 260.35,97.16 260.35,111.12 261.62,112.39 SLOT1.29 | v320.04,52.07 320.04,38.73 XESS.24 | v264.16,59.69 260.35,63.5 260.35,97.16
  Bottom 0.381: v320.04,52.07 312.42,59.69 v264.16,59.69
IDE-CS0#  (via drill 0.61)
  Top 0.381: v288.29,76.2 288.29,80.64 289.56,81.92 XESS.7 | v246.38,85.09 246.38,95.89 245.11,97.16 v245.11,120.65 | v250.19,123.19 251.46,124.46 251.46,130.18 IDE.37
  Bottom 0.381: v288.29,76.2 253.37,76.2 247.65,81.92 247.65,85.09 v246.38,85.09 | v245.11,120.65 247.65,123.19 v250.19,123.19
IDE-CS1#  (via drill 0.61)
  Top 0.381: v292.1,68.58 292.1,81.92 XESS.8 | v248.92,67.31 247.65,68.58 247.65,95.89 246.38,97.16 246.38,111.12 247.65,112.39 247.65,127.64 250.19,130.18 250.19,131.44 251.46,132.72 IDE.38
  Bottom 0.381: v292.1,68.58 290.83,67.31 v248.92,67.31
IDE-DMACK#  (via drill 0.61)
  Top 0.381: v237.49,36.83 234.95,36.83 234.95,90.17 240.03,95.25 v240.03,109.86 | v257.81,114.3 257.81,131.44 258.44,132.08 261.62,132.08 261.62,131.44 IDE.29
  Bottom 0.381: v237.49,36.83 269.88,36.83 271.14,38.1 XESS.43 | v240.03,109.86 244.47,114.3 v257.81,114.3
IDE-DMARQ  (via drill 0.61)
  Top 0.381: R17.2 314.96,103.5 314.96,102.23 R12.1 314.96,100.97 313.69,99.69 313.69,71.12 v308.61,66.04 | v273.05,63.5 273.05,55.24 256.54,38.73 XESS.49
  Bottom 0.381: v273.05,63.5 275.59,66.04 v308.61,66.04
IDE-IORDY  (via drill 0.61)
  Top 0.381: 316.23,94.61 317.5,95.89 R19.1 | 316.23,94.61 315.6,93.98 R15.1 | v312.42,46.99 316.23,50.8 316.23,94.61
  Bottom 0.381: v312.42,46.99 301.62,46.99 296.55,41.91 273.69,41.91 269.88,38.1 XESS.44
IDE-IRQ
  Bottom 0.381: R18.2 317.5,93.34 315.6,91.44 R16.1 314.32,91.44 313.06,91.44 307.98,86.36 283.85,86.36 280.04,82.55 XESS.3
IF0
  Bottom 0.381: IC1.6 36.2,123.83 43.18,116.84 47.62,116.84 48.26,116.2 48.26,114.3 50.16,114.3 51.44,113.03 C40.24
IF1
  Top 0.381: IC4.15 50.8,130.81 52.07,129.54 52.07,118.75 54.61,116.2 C40.25
IF2
  Bottom 0.381: IC4.2 50.8,123.19 50.8,114.94 51.44,114.3 62.87,114.3 64.14,113.03 C40.34
ION
  Top 0.381: IC16.3 340.36,123.19 339.09,121.92 339.09,112.39 341,110.49 350.52,110.49 350.52,112.39 D40.34
IOT
  Bottom 0.381: IC13.4 315.6,123.83 322.58,116.84 335.92,116.84 337.19,115.57 D40.23
ISZ
  Top 0.381: IC13.1 307.34,123.19 307.34,113.67 309.25,111.76 314.32,111.76 314.32,113.03 D40.6
JMP  (via drill 0.61)
  Top 0.381: v336.55,111.76 336.55,129.54 337.82,130.81 IC16.15
  Bottom 0.381: v336.55,111.76 324.49,111.76 323.21,113.03 D40.12
JMS
  Bottom 0.381: IC12.7 236.85,123.83 243.84,116.84 302.89,116.84 304.17,118.11 316.87,118.11 318.77,116.2 318.77,113.67 320.04,113.67 D40.10
LA
  Top 0.381: 113.03,30.48 113.03,34.29 111.12,34.29 109.86,33.02 R43.1 | 113.03,30.48 114.3,29.21 IC2.14 | 113.03,30.48 113.03,18.41 104.78,10.16 B40.18
LEFT  (via drill 0.61)  (1 unrouted)
  Top 0.381: IC8.9 149.86,130.81 155.57,125.09 171.45,125.09 171.45,111.12 167.64,107.31 SV2.1 | v200.66,108.58 200.66,105.41 IC9.14
  Bottom 0.381: v200.66,108.58 182.88,108.58 180.97,106.68 SV1.1
LINK
  Top 0.381: IC4.3 53.34,123.19 55.88,120.65 55.88,114.94 57.15,113.67 C40.28
LSCK  (via drill 0.61)  (1 unrouted)
  Top 0.381: SV1.3 180.34,104.78 179.07,106.05 179.07,107.31 174.62,111.76 174.62,136.53 199.39,136.53 201.93,133.99 201.93,130.18 206.38,130.18 207.65,131.44 IC10.11 208.28,130.81 v211.46,127.64 | v229.24,127.64 233.04,131.44 IC12.11 | IC19.1 310.51,12.06 311.79,12.06 IC19.2 312.42,13.97 312.42,14.61 321.94,14.61 326.39,19.05 326.39,97.16 328.93,99.69 328.93,136.53 345.44,136.53 346.71,135.25 346.71,134.62 347.98,133.35 IC16.11 | v299.72,101.6 300.36,102.23 v300.36,128.91 | IC1.11 36.2,131.44 37.47,130.18 49.53,130.18 49.53,133.35 50.16,133.99 60.96,133.99 60.96,133.35 IC4.11
  Bottom 0.381: v211.46,127.64 v229.24,127.64 | SV1.3 180.97,104.14 182.25,104.14 184.15,106.05 206.38,106.05 207.65,104.78 IC9.11 208.91,104.78 210.19,106.05 231.78,106.05 233.04,104.78 IC11.11 234.31,103.5 236.22,101.6 247.65,101.6 248.92,102.87 266.06,102.87 267.33,101.6 v299.72,101.6 | IC16.11 347.35,131.44 346.07,130.18 321.94,130.18 320.68,131.44 IC13.11 319.4,131.44 317.5,129.54 300.99,129.54 v300.36,128.91 | IC17.16 287.65,19.68 288.93,18.41 290.19,18.41 291.46,19.68 IC17.14 292.74,19.68 295.91,16.51 309.88,16.51 309.88,13.97 IC19.1 | 142.88,106.05 121.28,106.05 120.02,104.78 IC5.11 | 142.88,106.05 144.15,104.78 IC7.11 | 161.93,105.41 151.13,105.41 150.5,106.05 142.88,106.05 | 161.93,105.41 165.74,105.41 167,104.14 SV2.3 | IC4.11 61.59,131.44 63.5,129.54 116.84,129.54 118.75,131.44 IC6.11 120.02,131.44 121.28,130.18 142.88,130.18 144.15,131.44 IC8.11 145.41,131.44 147.32,129.54 153.03,129.54 160.02,136.53 171.45,136.53 171.45,129.54 168.91,127 161.93,127 161.93,105.41
LSER  (via drill 0.61)  (1 unrouted)
  Top 0.381: v280.67,68.58 280.67,22.86 281.94,21.59 IC17.18
  Bottom 0.381: v280.67,68.58 245.75,68.58 232.41,81.92 232.41,92.71 184.78,92.71 180.97,96.52 SV1.9 | IC1.14 27.3,131.44 24.13,128.27 20.95,128.27 19.05,126.36 19.05,94.61 165.1,94.61 167,96.52 SV2.9
MA0
  Top 0.381: IC5.1 106.68,97.79 107.95,99.06 107.95,109.86 110.49,112.39 110.49,113.67 109.22,114.94 E40.3
MA1  (via drill 0.61)
  Top 0.381: v120.65,107.31 120.65,99.06 119.38,97.79 IC5.6
  Bottom 0.381: v120.65,107.31 114.94,113.03 E40.8
MA2  (via drill 0.61)
  Top 0.381: v115.57,120.65 112.39,123.83 IC6.3 | v121.92,118.11 121.92,116.2 E40.13
  Bottom 0.381: v115.57,120.65 118.11,118.11 v121.92,118.11
MA3
  Top 0.381: IC7.15 134.62,105.41 132.72,107.31 132.72,111.76 132.08,112.39 E40.22
MA4
  Top 0.381: IC7.5 142.24,97.79 140.97,99.06 140.97,113.67 139.7,114.94 E40.27
MA5
  Bottom 0.381: IC8.2 134.62,123.19 134.62,118.75 138.43,118.75 140.97,116.2 140.97,114.3 142.88,114.3 144.15,113.03 E40.32
MA6
  Top 0.381: IC9.1 195.58,97.79 199.39,101.6 199.39,113.67 198.12,114.94 F40.3
MA7  (via drill 0.61)
  Top 0.381: v207.01,108.58 207.01,99.06 208.28,97.79 IC9.6
  Bottom 0.381: v207.01,108.58 203.2,112.39 F40.8
MA8
  Bottom 0.381: IC10.3 201.29,123.83 208.28,116.84 208.91,116.84 210.19,115.57 F40.13
MA9
  Top 0.381: IC11.15 223.52,105.41 222.25,106.68 222.25,111.12 220.98,112.39 F40.22
MA10
  Top 0.381: IC11.5 231.14,97.79 229.87,99.06 229.87,113.67 228.6,114.94 F40.27
MA11
  Bottom 0.381: IC12.2 223.52,123.19 223.52,116.84 231.78,116.84 232.41,116.2 232.41,113.67 233.68,113.67 F40.32
MASTER-RESET#  (via drill 0.61)
  Top 0.381: v308.61,15.24 308.61,64.14 307.34,65.41 307.34,80.64 308.61,81.92 308.61,85.72 303.53,90.81 303.53,99.06 302.89,99.69 299.72,99.69 299.72,97.16 297.81,95.25 SLOT2.1 297.18,95.89 295.91,97.16 295.91,98.42 297.18,99.69 297.18,112.39 SLOT1.1 | v300.36,130.81 303.53,127.64 303.53,125.09 304.8,123.83 v304.8,116.84
  Bottom 0.381: v308.61,15.24 284.48,15.24 282.57,13.34 IC17.3 | v300.36,130.81 297.81,130.81 IDE.1 | v304.8,116.84 300.99,113.03 297.81,113.03 SLOT1.1
MB0
  Top 0.381: IC5.2 109.86,95.89 111.12,94.61 113.03,94.61 113.03,113.67 111.76,114.94 E40.5
MB1  (via drill 0.61)
  Top 0.381: v105.41,107.31 105.41,93.34 118.75,93.34 121.28,95.89 IC5.7
  Bottom 0.381: v105.41,107.31 111.12,113.03 E40.6
MB2  (via drill 0.61)
  Top 0.381: v123.19,126.36 123.19,117.47 124.46,116.2 E40.15
  Bottom 0.381: v123.19,126.36 116.2,126.36 114.94,125.09 IC6.4
MB3  (via drill 0.61)
  Top 0.381: v125.73,98.42 124.46,99.69 124.46,101.6 123.19,102.87 123.19,111.12 124.46,112.39 E40.16
  Bottom 0.381: v125.73,98.42 130.18,98.42 131.44,97.16 IC7.1
MB4
  Top 0.381: IC7.6 144.78,97.79 143.51,99.06 143.51,113.67 142.24,114.94 E40.29
MB5
  Bottom 0.381: IC8.3 137.79,123.83 143.51,118.11 146.69,118.11 148.59,116.2 148.59,111.76 144.15,111.76 142.88,113.03 E40.30
MB6
  Top 0.381: IC9.2 198.12,97.79 201.93,101.6 201.93,113.67 200.66,114.94 F40.5
MB7
  Top 0.381: IC9.7 210.82,97.79 212.09,99.06 212.09,109.86 209.55,112.39 209.55,116.2 208.91,116.84 199.39,116.84 199.39,114.94 200.66,113.67 F40.6
MB8
  Bottom 0.381: IC10.4 203.84,123.83 210.82,116.84 211.46,116.84 212.72,115.57 F40.15
MB9  (via drill 0.61)
  Top 0.381: v217.17,98.42 214.63,100.97 214.63,107.31 213.36,108.58 213.36,112.39 F40.16
  Bottom 0.381: v217.17,98.42 219.07,98.42 220.34,97.16 IC11.1
MB10
  Top 0.381: IC11.6 233.68,97.79 232.41,99.06 232.41,113.67 231.14,114.94 F40.29
MB11  (via drill 0.61)
  Top 0.381: v229.87,119.38 229.87,114.94 231.14,113.67 F40.30
  Bottom 0.381: v229.87,119.38 226.06,123.19 IC12.3
MQ0
  Top 0.381: IC5.4 114.94,95.89 116.2,94.61 118.11,94.61 118.11,113.67 116.84,114.94 E40.9
MQ1
  Top 0.381: IC6.1 106.68,123.19 105.41,121.92 105.41,114.94 106.68,113.67 E40.2
MQ2
  Bottom 0.381: IC6.6 118.75,123.83 116.84,121.92 114.94,121.92 114.3,121.28 114.3,116.84 114.94,116.84 115.57,116.2 115.57,114.3 132.72,114.3 133.99,115.57 E40.23
MQ3  (via drill 0.61)
  Top 0.381: v127,107.31 127,94.61 135.25,94.61 136.53,95.89 IC7.3
  Bottom 0.381: v127,107.31 122.56,111.76 121.28,111.76 120.02,113.03 E40.12
MQ4  (via drill 0.61)
  Top 0.381: v135.89,122.56 135.89,129.54 134.62,130.81 IC8.15
  Bottom 0.381: v135.89,122.56 141.6,116.84 145.41,116.84 146.69,115.57 E40.33
MQ5
  Top 0.381: IC8.5 141.6,125.09 140.34,126.36 138.43,126.36 138.43,118.75 135.89,116.2 135.89,114.94 137.16,113.67 E40.26
MQ6
  Top 0.381: IC9.4 203.84,95.89 205.1,94.61 209.55,94.61 209.55,109.86 207.01,112.39 207.01,113.67 205.74,114.94 F40.9
MQ7
  Top 0.381: IC10.1 195.58,123.19 194.31,121.92 194.31,114.94 195.58,113.67 F40.2
MQ8
  Bottom 0.381: IC10.6 208.91,123.83 214.63,118.11 220.34,118.11 222.88,115.57 F40.23
MQ9  (via drill 0.61)
  Top 0.381: v219.71,108.58 219.71,94.61 224.16,94.61 225.43,95.89 IC11.3
  Bottom 0.381: v219.71,108.58 217.81,110.49 211.46,110.49 208.91,113.03 F40.12
MQ10
  Top 0.381: IC12.15 223.52,130.81 227.97,126.36 234.95,126.36 234.95,117.47 236.22,116.2 F40.33
MQ11  (via drill 0.61)
  Top 0.381: v226.06,118.11 224.79,116.84 224.79,114.94 226.06,113.67 F40.26
  Bottom 0.381: v226.06,118.11 231.14,118.11 231.14,123.19 IC12.5
N$1
  Bottom 0.381: IC14.9 41.27,28.57 42.55,29.84 64.14,29.84 65.41,28.57 IC15.10
N$2
  Bottom 0.381: IC15.9 69.22,28.57 70.48,29.84 122.56,29.84 123.83,28.57 IC2.10
N$3
  Bottom 0.381: IC18.10 97.16,27.3 99.06,25.4 124.46,25.4 126.36,27.3 IC2.9
N$4
  Top 0.381: IC5.9 124.46,105.41 125.73,106.68 125.73,134.62 123.83,136.53 111.76,136.53 111.76,133.35 IC6.14
N$5
  Top 0.381: IC3.10 241.3,21.59 241.3,27.3 R3.2
N$6
  Top 0.381: IC3.11 238.76,21.59 238.76,24.77 R1.2
N$7  (via drill 0.61)
  Top 0.381: v267.97,21.59 271.78,17.78 v271.78,10.79 | v294.64,6.99 299.72,1.91 337.19,1.91 337.19,5.08 R2.2
  Bottom 0.381: v267.97,21.59 245.11,21.59 244.47,20.95 IC3.9 | v271.78,10.79 275.59,6.99 v294.64,6.99
N$8
  Top 0.381: C1.2 228.6,8.26 228.6,11.43 IC3.2
N$9
  Top 0.381: C2.2 231.14,5.71 231.14,11.43 IC3.3
N$10
  Bottom 0.381: IC1.9 41.27,132.72 42.55,133.99 51.44,133.99 52.7,132.72 IC4.14
N$11
  Top 0.381: C2.1 226.06,5.71 226.06,11.43 IC3.1
N$12
  Top 0.381: C4.1 241.3,5.71 240.03,6.99 240.03,10.16 238.76,11.43 IC3.6
N$13
  Top 0.381: IC7.9 149.86,105.41 149.86,121.92 148.59,123.19 148.59,125.73 146.69,127.64 137.16,127.64 137.16,130.81 IC8.14
N$14  (via drill 0.61)
  Top 0.381: v124.46,128.91 124.46,130.81 IC6.9 | v133.35,128.91 133.35,112.39 135.89,109.86 137.16,109.86 137.16,105.41 IC7.14
  Bottom 0.381: v124.46,128.91 v133.35,128.91
N$15
  Top 0.381: IC11.9 238.76,105.41 238.76,121.92 240.03,123.19 240.03,135.25 238.76,136.53 229.87,136.53 229.87,130.81 229.24,130.18 226.06,130.18 226.06,130.81 IC12.14
N$16  (via drill 0.61)
  Top 0.381: v217.17,130.18 217.17,119.38 219.71,116.84 219.71,114.3 221.62,114.3 222.25,113.67 222.25,112.39 222.88,111.76 224.79,111.76 226.06,110.49 226.06,105.41 IC11.14
  Bottom 0.381: v217.17,130.18 215.9,131.44 214,131.44 IC10.9
N$17  (via drill 0.61)
  Top 0.381: v333.38,132.72 334.64,133.99 340.36,133.99 340.36,133.35 IC16.14
  Bottom 0.381: v333.38,132.72 325.75,132.72 IC13.9
N$18
  Top 0.381: C3.1 233.68,8.26 233.68,11.43 IC3.4
N$19
  Top 0.381: IC9.9 213.36,102.87 213.36,99.06 212.09,97.79 212.09,95.25 210.19,93.34 189.87,93.34 189.87,129.54 194.31,133.99 200.66,133.99 200.66,133.35 IC10.14
N$20
  Top 0.381: C3.2 238.76,8.26 236.22,10.79 236.22,11.43 IC3.5
N$21  (via drill 0.61)
  Top 0.381: v80.01,116.84 66.04,130.81 IC4.9
  Bottom 0.381: v80.01,116.84 107.31,116.84 107.95,116.2 107.95,111.76 107.31,111.76 104.14,108.58 104.14,106.05 109.86,106.05 111.12,104.78 IC5.14
N$22  (via drill 0.61)
  Top 0.381: v342.26,25.4 358.77,41.91 358.77,129.54 356.24,132.08 353.69,132.08 IC16.9
  Bottom 0.381: v342.26,25.4 332.74,25.4 320.68,13.34 IC19.5
N$23  (via drill 0.61)
  Top 0.381: v275.59,128.91 v275.59,120.65 | v309.88,119.38 311.15,120.65 311.15,129.54 312.42,130.81 IC13.14
  Bottom 0.381: v275.59,128.91 248.92,128.91 245.75,132.08 239.4,132.08 IC12.9 | v275.59,120.65 276.86,119.38 v309.88,119.38
N$27
  Top 0.381: IC19.3 315.6,12.06 316.87,12.06 IC19.4
N$28
  Top 0.381: R11.1 289.56,4.45 292.1,6.99 292.1,11.43 IC17.7
N$29
  Top 0.381: R21.2 261.62,106.05 262.89,107.31 262.89,113.67 262.25,114.3 259.08,114.3 259.08,113.67 SLOT1.31
N$30
  Top 0.381: R22.2 259.08,104.78 259.08,99.69 257.81,98.42 257.81,97.16 259.08,95.89 SLOT2.31
N$31
  Top 0.381: C5.1 264.16,17.14 264.16,16.51 RESET.2 263.52,13.97 263.52,3.81 RESET.1 264.8,3.81 283.21,3.81 290.83,11.43 290.83,13.97 285.12,19.68 IC17.17 | R23.2 271.78,27.3 266.7,22.23 266.7,18.41 R20.2
  Bottom 0.381: R20.2 266.06,17.78 264.8,17.78 C5.1
N$52  (via drill 0.61)
  Top 0.381: v316.23,119.38 316.23,112.39 313.69,109.86 313.69,100.97 304.8,92.08 R16.2 | v264.16,122.56 259.08,127.64 259.08,130.18 IDE.31
  Bottom 0.381: v316.23,119.38 314.96,120.65 296.55,120.65 294.64,122.56 v264.16,122.56
N$53  (via drill 0.61)
  Top 0.381: v307.34,109.22 307.34,97.16 304.8,94.61 R15.2 | v265.43,111.76 265.43,128.91 264.16,130.18 IDE.27
  Bottom 0.381: v307.34,109.22 278.13,109.22 275.59,111.76 v265.43,111.76
N$54  (via drill 0.61)
  Top 0.381: v306.07,121.92 306.07,98.42 304.8,97.16 R14.2 | v271.14,123.83 266.7,128.27 266.7,130.18 IDE.25
  Bottom 0.381: v306.07,121.92 296.55,121.92 294.64,123.83 v271.14,123.83
N$55  (via drill 0.61)
  Top 0.381: v303.53,123.19 303.53,100.97 304.8,99.69 R13.2 | v272.42,125.09 269.24,128.27 269.24,130.18 IDE.23
  Bottom 0.381: v303.53,123.19 296.55,123.19 294.64,125.09 v272.42,125.09
N$56  (via drill 0.61)
  Top 0.381: v302.26,101.6 301.62,102.23 v301.62,124.46 | v273.05,126.36 271.78,127.64 271.78,130.18 IDE.21
  Bottom 0.381: v302.26,101.6 304.17,101.6 R12.2 | v301.62,124.46 296.55,124.46 294.64,126.36 v273.05,126.36
OPR  (via drill 0.61)
  Top 0.381: v325.12,121.28 326.39,120.02 326.39,114.94 327.66,113.67 D40.16
  Bottom 0.381: v325.12,121.28 324.49,121.28 322.58,123.19 IC13.7
PAUSE  (via drill 0.61)
  Top 0.381: v347.98,118.11 347.98,116.2 D40.31
  Bottom 0.381: v347.98,118.11 341.63,118.11 335.92,123.83 IC16.1
PB-A0  (via drill 0.61)
  Top 0.381: v240.03,87.63 240.03,42.55 236.22,38.73 XESS.57 | 252.73,111.12 254,112.39 SLOT1.35 | 252.73,111.12 252.73,97.16 254,95.89 SLOT2.35 | 252.73,111.12 252.73,128.91 254,130.18 IDE.35
  Bottom 0.381: v240.03,87.63 246.38,93.98 252.09,93.98 253.37,95.25 SLOT2.35
PB-A1  (via drill 0.61)
  Top 0.381: IDE.33 256.54,130.18 256.54,117.47 255.27,116.2 255.27,114.94 256.54,113.67 SLOT1.33 256.54,112.39 256.54,99.69 255.27,98.42 255.27,97.16 256.54,95.89 SLOT2.33 | v245.11,90.81 245.11,45.09 238.76,38.73 XESS.56
  Bottom 0.381: v245.11,90.81 247.01,92.71 253.37,92.71 255.91,95.25 SLOT2.33
PB-A2
  Top 0.381: XESS.51 251.46,38.73 252.73,40.01 252.73,79.38 255.27,81.92 255.27,95.89 254,97.16 SLOT2.36 254,98.42 255.27,99.69 255.27,113.67 254,114.94 SLOT1.36 254,116.2 255.27,117.47 255.27,131.44 254,132.72 IDE.36
PB-A3  (via drill 0.61)
  Top 0.381: SLOT2.38 251.46,98.42 251.46,111.12 250.19,112.39 250.19,113.67 251.46,114.94 SLOT1.38 | v257.81,93.98 257.81,81.92 254,78.11 254,38.73 XESS.50
  Bottom 0.381: v257.81,93.98 257.81,96.52 253.37,96.52 252.09,97.79 SLOT2.38
PB-A4
  Top 0.381: SLOT1.39 248.92,112.39 247.65,111.12 247.65,97.16 248.92,95.89 SLOT2.39
  Bottom 0.381: XESS.70 236.22,83.19 236.22,92.71 243.84,92.71 246.38,95.25 248.28,95.25 SLOT2.39
PB-D0  (via drill 0.61)
  Top 0.381: IDE.17 276.86,130.18 276.86,119.38 275.59,118.11 275.59,114.94 276.86,113.67 SLOT1.17 276.86,112.39 276.86,99.69 275.59,98.42 275.59,97.16 276.86,95.89 SLOT2.17 276.86,94.61 v276.86,86.36
  Bottom 0.381: v276.86,86.36 243.21,86.36 239.4,82.55 XESS.71
PB-D1
  Top 0.381: IDE.15 279.4,130.18 279.4,117.47 278.13,116.2 278.13,114.94 279.4,113.67 SLOT1.15 279.4,112.39 279.4,99.69 278.13,98.42 278.13,93.34 | 278.13,93.34 278.13,81.92 279.4,80.64 279.4,38.73 XESS.40 | 278.13,93.34 279.4,94.61 SLOT2.15
PB-D2
  Top 0.381: IDE.13 281.94,130.18 281.94,117.47 280.67,116.2 280.67,114.94 281.94,113.67 SLOT1.13 281.94,112.39 281.94,99.69 280.67,98.42 280.67,93.34 | 280.67,93.34 280.67,81.92 281.94,80.64 281.94,38.73 XESS.39 | 280.67,93.34 281.94,94.61 SLOT2.13
PB-D3
  Top 0.381: IDE.11 284.48,130.18 284.48,117.47 283.21,116.2 283.21,114.94 284.48,113.67 SLOT1.11 284.48,112.39 284.48,99.69 283.21,98.42 283.21,97.16 284.48,95.89 SLOT2.11 284.48,94.61 284.48,87 283.21,85.72 283.21,81.92 284.48,80.64 284.48,38.73 XESS.38
PB-D4
  Top 0.381: IDE.9 287.02,130.18 287.02,117.47 285.75,116.2 285.75,114.94 287.02,113.67 SLOT1.9 287.02,112.39 287.02,99.69 285.75,98.42 285.75,97.16 287.02,95.89 SLOT2.9 287.02,94.61 287.02,87.63 290.83,83.82 290.83,40.01 292.1,38.73 XESS.35
PB-D5  (via drill 0.61)
  Top 0.381: IDE.7 289.56,130.18 289.56,117.47 288.29,116.2 288.29,114.94 289.56,113.67 SLOT1.7 289.56,112.39 289.56,99.69 288.29,98.42 v288.29,88.9 289.56,90.17 289.56,94.61 SLOT2.7
  Bottom 0.381: v288.29,88.9 278.13,88.9 278.13,81.92 277.5,81.28 263.52,81.28 262.25,82.55 XESS.80
PB-D6  (via drill 0.61)
  Top 0.381: IDE.5 292.1,130.18 292.1,117.47 290.83,116.2 290.83,114.94 292.1,113.67 SLOT1.5 292.1,112.39 292.1,99.69 290.83,98.42 290.83,97.16 292.1,95.89 SLOT2.5 292.1,94.61 v292.1,90.17 | v264.16,87.63 264.16,83.19 XESS.81
  Bottom 0.381: v264.16,87.63 266.7,90.17 v292.1,90.17
PB-D7
  Top 0.381: XESS.10 297.18,83.19 297.18,92.08 294.64,94.61 SLOT2.3 294.64,95.89 293.37,97.16 293.37,98.42 294.64,99.69 294.64,112.39 SLOT1.3 294.64,113.67 293.37,114.94 293.37,116.2 294.64,117.47 294.64,130.18 IDE.3
PB-D8  (via drill 0.61)
  Top 0.381: v298.45,41.91 298.45,92.08 295.91,94.61 295.91,95.89 294.64,97.16 SLOT2.4 294.64,98.42 295.91,99.69 295.91,113.67 | 295.91,113.67 294.64,114.94 SLOT1.4 | 295.91,113.67 295.91,131.44 294.64,132.72 IDE.4
  Bottom 0.381: v298.45,41.91 297.81,41.91 296.55,40.64 293.37,40.64 293.37,37.47 294,36.83 310.51,36.83 311.79,38.1 XESS.27
PB-D9  (via drill 0.61)
  Top 0.381: v309.88,52.07 309.88,38.73 XESS.28 | v300.99,58.42 v300.99,96.52 | SLOT2.6 292.1,98.42 293.37,99.69 293.37,113.67 292.1,114.94 SLOT1.6 292.1,116.2 293.37,117.47 293.37,131.44 292.1,132.72 IDE.6
  Bottom 0.381: v309.88,52.07 303.53,58.42 v300.99,58.42 | v300.99,96.52 294,96.52 292.74,97.79 SLOT2.6
PB-D10  (via drill 0.61)
  Top 0.381: v304.8,45.72 304.8,80.64 303.53,81.92 303.53,89.53 302.26,90.81 v302.26,98.42 | SLOT2.8 289.56,98.42 290.83,99.69 290.83,113.67 289.56,114.94 SLOT1.8 289.56,116.2 290.83,117.47 290.83,131.44 289.56,132.72 IDE.8
  Bottom 0.381: v304.8,45.72 313.69,45.72 313.69,40.01 313.06,39.37 309.25,39.37 307.98,38.1 XESS.29 | v302.26,98.42 300.36,100.33 292.74,100.33 290.19,97.79 SLOT2.8
PB-D11  (via drill 0.61)
  Top 0.381: v290.83,93.98 290.83,89.53 295.91,84.45 295.91,42.55 299.72,38.73 XESS.32 | SLOT2.10 287.02,98.42 288.29,99.69 288.29,113.67 287.02,114.94 SLOT1.10 287.02,116.2 288.29,117.47 288.29,131.44 287.02,132.72 IDE.10
  Bottom 0.381: v290.83,93.98 290.83,96.52 288.93,96.52 287.65,97.79 SLOT2.10
PB-D12  (via drill 0.61)
  Top 0.381: v288.93,87.63 293.37,83.19 293.37,42.55 297.18,38.73 XESS.33 | v283.21,87.63 v283.21,93.98 | SLOT2.12 284.48,98.42 285.75,99.69 285.75,113.67 284.48,114.94 SLOT1.12 284.48,116.2 285.75,117.47 285.75,131.44 284.48,132.72 IDE.12
  Bottom 0.381: v288.93,87.63 v283.21,87.63 | v283.21,93.98 283.21,97.79 283.85,97.79 SLOT2.12
PB-D13  (via drill 0.61)
  Top 0.381: v312.42,40.64 318.77,46.99 v318.77,83.82 | SLOT2.14 281.94,98.42 283.21,99.69 283.21,113.67 281.94,114.94 SLOT1.14 281.94,116.2 283.21,117.47 283.21,131.44 281.94,132.72 IDE.14
  Bottom 0.381: v312.42,40.64 297.81,40.64 295.27,38.1 XESS.34 | v318.77,83.82 318.77,95.25 299.08,95.25 296.55,92.71 282.57,92.71 280.67,94.61 280.67,97.16 281.94,97.16 SLOT2.14
PB-D14  (via drill 0.61)
  Top 0.381: v285.75,93.98 285.75,81.92 287.02,80.64 287.02,75.56 288.29,74.3 288.29,40.01 289.56,38.73 XESS.36 | SLOT2.16 279.4,98.42 280.67,99.69 280.67,113.67 279.4,114.94 SLOT1.16 279.4,116.2 280.67,117.47 280.67,131.44 279.4,132.72 IDE.16
  Bottom 0.381: v285.75,93.98 285.75,99.06 281.31,99.06 280.04,97.79 SLOT2.16
PB-D15  (via drill 0.61)